# EAGLE design marquee-control (EAGLE 5.11)
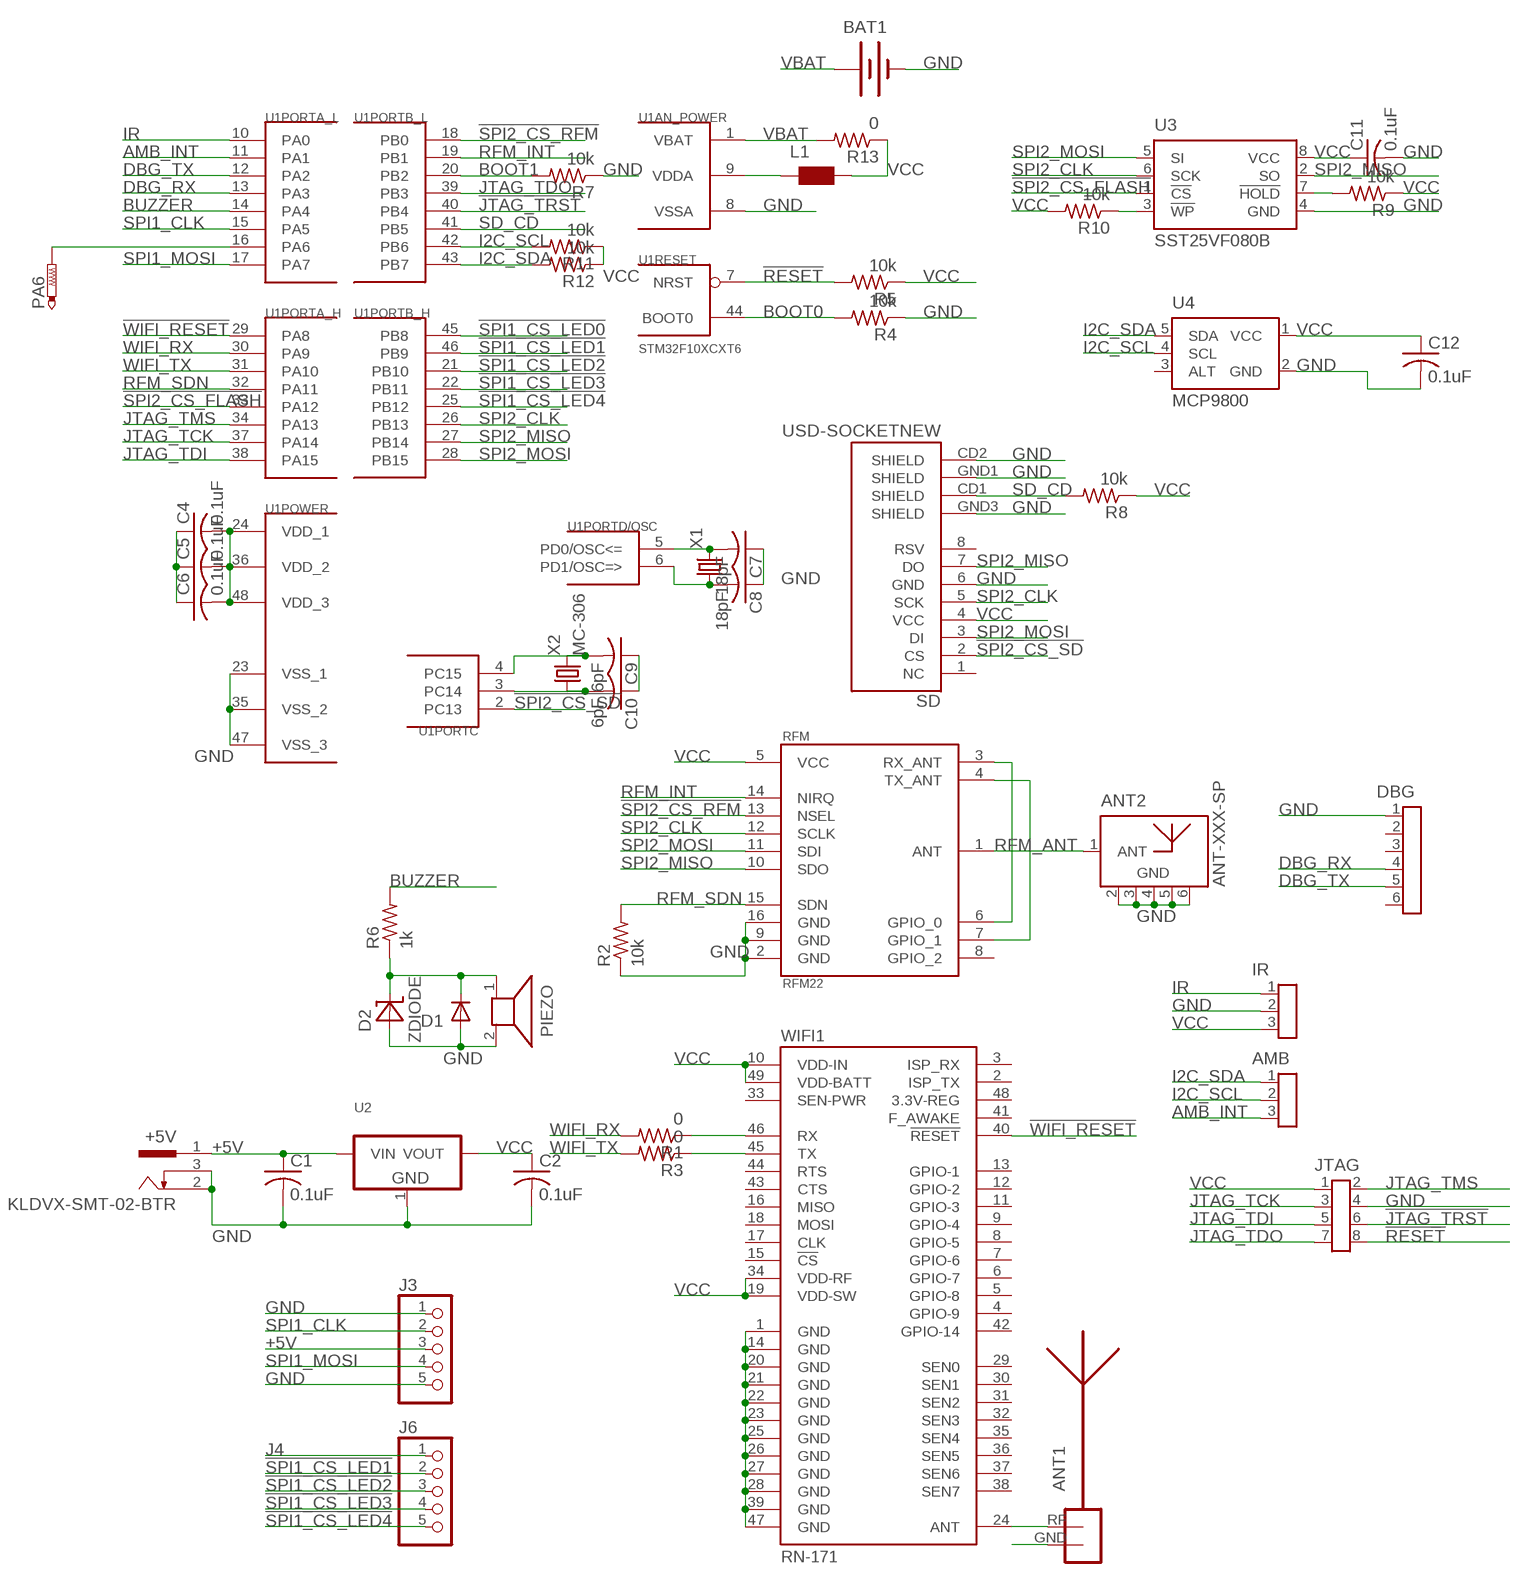
[diagram p0: schematic, sheet 1]

## Parts
+5V  KLDVX-SMT-02-BTR  [KLDVX-SMT-02-BTR]
AMB  PH-3  [SIL-3]
ANT1  ANTENNA_1LEFT  [SWRA117D_LEFT]
ANT2  ANT-XXX-SP  [ANT-XXX-SP]
BAT1  BATTERY12MM  [BATTCON_12MM]
C1  0.1uF  C-USC0603  [C0603]
C2  0.1uF  C-USC0603  [C0603]
C4  0.1uF  C-USC0603  [C0603]
C5  0.1uF  C-USC0603  [C0603]
C6  0.1uF  C-USC0603  [C0603]
C7  18pF  C-USC0603  [C0603]
C8  18pF  C-USC0603  [C0603]
C9  6pF  C-USC0603  [C0603]
C10  6pF  C-USC0603  [C0603]
C11  0.1uF  C-USC0603  [C0603]
C12  0.1uF  C-USC0603  [C0603]
D1  1N4148DO35-7  DIODE-SOD123  [SOD123]
D2  ZDIODE  [SOD-123]
DBG  PH-6  [SIL-6]
IR  PH-3  [SIL-3]
J3  PINHD-1X5  [1X05]
J6  PINHD-1X5  [1X05]
JTAG  PH-2X4  [DIL-8]
L1  WE-CBF_0603  [0603]
PA6  PTR1B1,27  [B1,27]
PIEZO  AST1628MATRQ  [AST1628MATRQ]
R1  0  R-US_R0603  [R0603]
R2  10k  R-US_R0603  [R0603]
R3  0  R-US_R0603  [R0603]
R4  10k  R-US_R0603  [R0603]
R5  10k  R-US_R0603  [R0603]
R6  1k  R-US_R0603  [R0603]
R7  10k  R-US_R0603  [R0603]
R8  10k  R-US_R0603  [R0603]
R9  10k  R-US_R0603  [R0603]
R10  10k  R-US_R0603  [R0603]
R11  10k  R-US_R0603  [R0603]
R12  10k  R-US_R0603  [R0603]
R13  0  R-US_R0603  [R0603]
RFM  RFM22  [RFM22-XXX-S2]
SD  USD-SOCKETNEW  [MICRO-SD-SOCKET-PP]
U1  STM32F10XCXT6  [TQFP48]
U2  LD1117-3.3SOT223  [SOT223]
U3  SST25VF080B  [SO-08]
U4  MCP9800  [SOT23-5L]
WIFI1  RN-171  [RN-171]
X1  CRYSTALCTS406  [CTS406]
X2  MC-306  [MC-306]

## Nets
!JTAG_TRST: JTAG.6 U1.40(PORTB_L:PB4)
!RESET: JTAG.8 R5.2 U1.7(RESET:NRST)
!SPI1_CS_LED0: U1.45(PORTB_H:PB8)
!SPI1_CS_LED1: J6.2 U1.46(PORTB_H:PB9)
!SPI1_CS_LED2: J6.3 U1.21(PORTB_H:PB10)
!SPI1_CS_LED3: J6.4 U1.22(PORTB_H:PB11)
!SPI1_CS_LED4: J6.5 U1.25(PORTB_H:PB12)
!SPI2_CS_FLASH: U1.33(PORTA_H:PA12) U3.1(!CS)
!SPI2_CS_RFM: RFM.13(NSEL) U1.18(PORTB_L:PB0)
!SPI2_CS_SD: SD.2(CS) U1.2(PORTC:PC13)
!WIFI_RESET: U1.29(PORTA_H:PA8) WIFI1.40(!RESET)
+5V: +5V.1 C1.1 J3.3 U2.3(VIN)
AMB_INT: AMB.3 U1.11(PORTA_L:PA1)
BOOT0: R4.2 U1.44(RESET:BOOT0)
BOOT1: R7.2 U1.20(PORTB_L:PB2)
BUZZER: R6.2 U1.14(PORTA_L:PA4)
DBG_RX: DBG.4 U1.13(PORTA_L:PA3)
DBG_TX: DBG.5 U1.12(PORTA_L:PA2)
GND: +5V.2 +5V.3 ANT1.GND ANT2.2(GND) ANT2.3(GND) ANT2.4(GND) ANT2.5(GND) ANT2.6(GND) BAT1.GND(-) C1.2 C2.2 C4.1 C5.1 C6.1 C7.1 C8.1 C9.1 C10.1 C11.2 C12.2 D1.A D2.A DBG.1 IR.2 J3.1 J3.5 JTAG.4 PIEZO.2 R2.1 R4.1 R7.1 RFM.2(GND) RFM.9(GND) RFM.16(GND) SD.6(GND) SD.CD2(SHIELD) SD.GND1(SHIELD) SD.GND3(SHIELD) U1.8(AN_POWER:VSSA) U1.23(POWER:VSS_1) U1.35(POWER:VSS_2) U1.47(POWER:VSS_3) U2.1(GND) U3.4(GND) U4.2(GND) WIFI1.1(GND) WIFI1.14(GND) WIFI1.20(GND) WIFI1.21(GND) WIFI1.22(GND) WIFI1.23(GND) WIFI1.25(GND) WIFI1.26(GND) WIFI1.27(GND) WIFI1.28(GND) WIFI1.39(GND) WIFI1.47(GND)
I2C_SCL: AMB.2 R11.2 U1.42(PORTB_L:PB6) U4.4(SCL)
I2C_SDA: AMB.1 R12.2 U1.43(PORTB_L:PB7) U4.5(SDA)
IR: IR.1 U1.10(PORTA_L:PA0)
J4: J6.1
JTAG_TCK: JTAG.3 U1.37(PORTA_H:PA14)
JTAG_TDI: JTAG.5 U1.38(PORTA_H:PA15)
JTAG_TDO: JTAG.7 U1.39(PORTB_L:PB3)
JTAG_TMS: JTAG.2 U1.34(PORTA_H:PA13)
N$1: D1.C D2.C PIEZO.1 R6.1
N$2: RFM.3(RX_ANT) RFM.6(GPIO_0)
N$3: RFM.4(TX_ANT) RFM.7(GPIO_1)
N$9: PA6.TP U1.16(PORTA_L:PA6)
N$10: L1.1 U1.9(AN_POWER:VDDA)
N$11: C7.2 U1.5(PORTD/OSC:PD0/OSC<=) X1.3
N$12: C8.2 U1.6(PORTD/OSC:PD1/OSC=>) X1.1
N$13: C10.2 U1.3(PORTC:PC14) X2.1
N$14: C9.2 U1.4(PORTC:PC15) X2.4
N$15: R10.1 U3.3(!WP)
N$18: R1.1 WIFI1.46(RX)
N$19: R3.1 WIFI1.45(TX)
N$22: R9.2 U3.7(!HOLD)
RFM_ANT: ANT2.1(ANT) RFM.1(ANT)
RFM_INT: RFM.14(NIRQ) U1.19(PORTB_L:PB1)
RFM_SDN: R2.2 RFM.15(SDN) U1.32(PORTA_H:PA11)
SD_CD: R8.2 SD.CD1(SHIELD) U1.41(PORTB_L:PB5)
SPI1_CLK: J3.2 U1.15(PORTA_L:PA5)
SPI1_MOSI: J3.4 U1.17(PORTA_L:PA7)
SPI2_CLK: RFM.12(SCLK) SD.5(SCK) U1.26(PORTB_H:PB13) U3.6(SCK)
SPI2_MISO: RFM.10(SDO) SD.7(DO) U1.27(PORTB_H:PB14) U3.2(SO)
SPI2_MOSI: RFM.11(SDI) SD.3(DI) U1.28(PORTB_H:PB15) U3.5(SI)
VBAT: BAT1.PWR@1(+) R13.2 U1.1(AN_POWER:VBAT)
VCC: C2.1 C4.2 C5.2 C6.2 C11.1 C12.1 IR.3 JTAG.1 L1.2 R5.1 R8.1 R9.1 R10.2 R11.1 R12.1 R13.1 RFM.5(VCC) SD.4(VCC) U1.24(POWER:VDD_1) U1.36(POWER:VDD_2) U1.48(POWER:VDD_3) U2.2(VOUT) U3.8(VCC) U4.1(VCC) WIFI1.10(VDD-IN) WIFI1.19(VDD-SW) WIFI1.34(VDD-RF) WIFI1.49(VDD-BATT)
WIFI_ANT: ANT1.RF WIFI1.24(ANT)
WIFI_RX: R1.2 U1.30(PORTA_H:PA9)
WIFI_TX: R3.2 U1.31(PORTA_H:PA10)
Unconnected: DBG.2 DBG.3 DBG.6 RFM.8(GPIO_2) SD.1(NC) SD.8(RSV) U4.3(ALT) WIFI1.2(ISP_TX) WIFI1.3(ISP_RX) WIFI1.4(GPIO-9) WIFI1.5(GPIO-8) WIFI1.6(GPIO-7) WIFI1.7(GPIO-6) WIFI1.8(GPIO-5) WIFI1.9(GPIO-4) WIFI1.11(GPIO-3) WIFI1.12(GPIO-2) WIFI1.13(GPIO-1) WIFI1.15(!CS) WIFI1.16(MISO) WIFI1.17(CLK) WIFI1.18(MOSI) WIFI1.29(SEN0) WIFI1.30(SEN1) WIFI1.31(SEN2) WIFI1.32(SEN3) WIFI1.33(SEN-PWR) WIFI1.35(SEN4) WIFI1.36(SEN5) WIFI1.37(SEN6) WIFI1.38(SEN7) WIFI1.41(F_AWAKE) WIFI1.42(GPIO-14) WIFI1.43(CTS) WIFI1.44(RTS) WIFI1.48(3.3V-REG)

## Library data of the parts
+5V = marquee-control:KLDVX-SMT-02-BTR
AMB IR = marquee-control:PH-3
ANT1 = ant-planar:ANTENNA_1
ANT2 = linx:ANT-XXX-SP: ANT-315-SP Source: http://www.antennafactor.com/documents/ANT-315-SP_Data_Sheet.pdf; OC_FARNELL: unknown; OC_NEWARK: unknown
BAT1 = sparkfun:BATTERY: Battery Holders Various common sizes : AA, AAA, 20mm coin cell and 12mm coin cell.
C1 C2 C4-C12 = rcl:C-US: CAPACITOR, American symbol
D1 = diode:DIODE-: DIODE
D2 = marquee-control:ZDIODE
DBG = marquee-control:PH-6
J3 J6 = pinhead:PINHD-1X5: PIN HEADER
JTAG = marquee-control:PH-2X4
L1 = wuerth-elektronik:WE-CBF: SMD EMI Suppression Ferrite Beads - excellent anti-EMI properties - low DCR - impedances till 3000 ohms - rated current up to 6 A
PA6 = testpad:PTR1: TEST PIN
PIEZO = marquee-control:AST1628MATRQ: Audio Indicators & Alerts 3MM HEIGHT 4000HZ 85DB Datasheet <http://www.mallory-sonalert.com/specifications/AST1628MATRQ.pdf>
R1-R13 = rcl:R-US_: RESISTOR, American symbol
RFM = sparkfun:RFM22: *Hope RF's RFM22* Packages: RFM22-S2 (SMD)
SD = sparkfun:USD-SOCKET: microSD Socket Push-push type uSD socket. Schematic element and footprint production proven. Spark Fun Electronics SKU : PRT-00127. tDoc lines correctly indicate media card edge positions when inserting (unlocked, locked, depressed).
U1 = stm32:STM32F10XCXT6: ST STM32F101/103 48pin LQFP
U2 = dp_devices:LD1117-3.3
U3 = marquee-control:SST25VF080B
U4 = marquee-control:MCP9800
WIFI1 = marquee-control:RN-171: Roving Netowrks WiFLy GSX Module
X1 = crystal:CRYSTAL: CRYSTAL; OC_FARNELL: unknown; OC_NEWARK: unknown
X2 = crystal:MC-306: kHz RANGE CRYSTAL UNIT SMD Source: MC-306_405_406_E07X.PDF Homepage <www.epsontoyocom.co.jp>; MPN: MC-306 60.0KHZ 100PPM ,12.5PF; OC_FARNELL: 1278040; OC_NEWARK: 31M5576

## Board
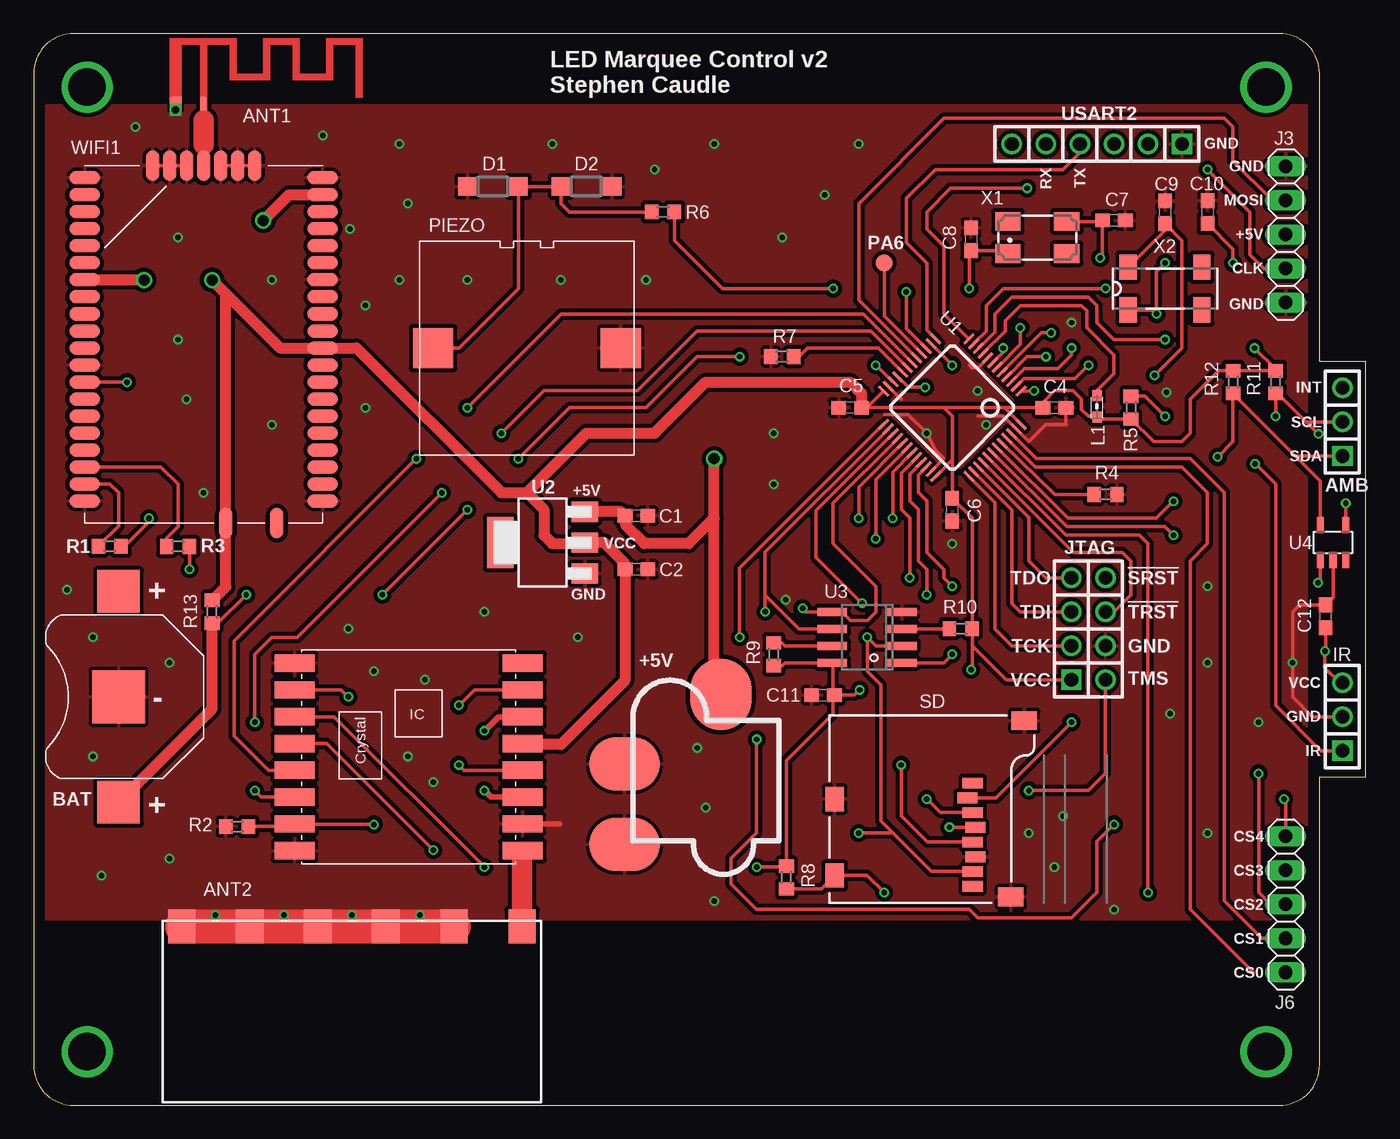
[diagram p1: board, top side]
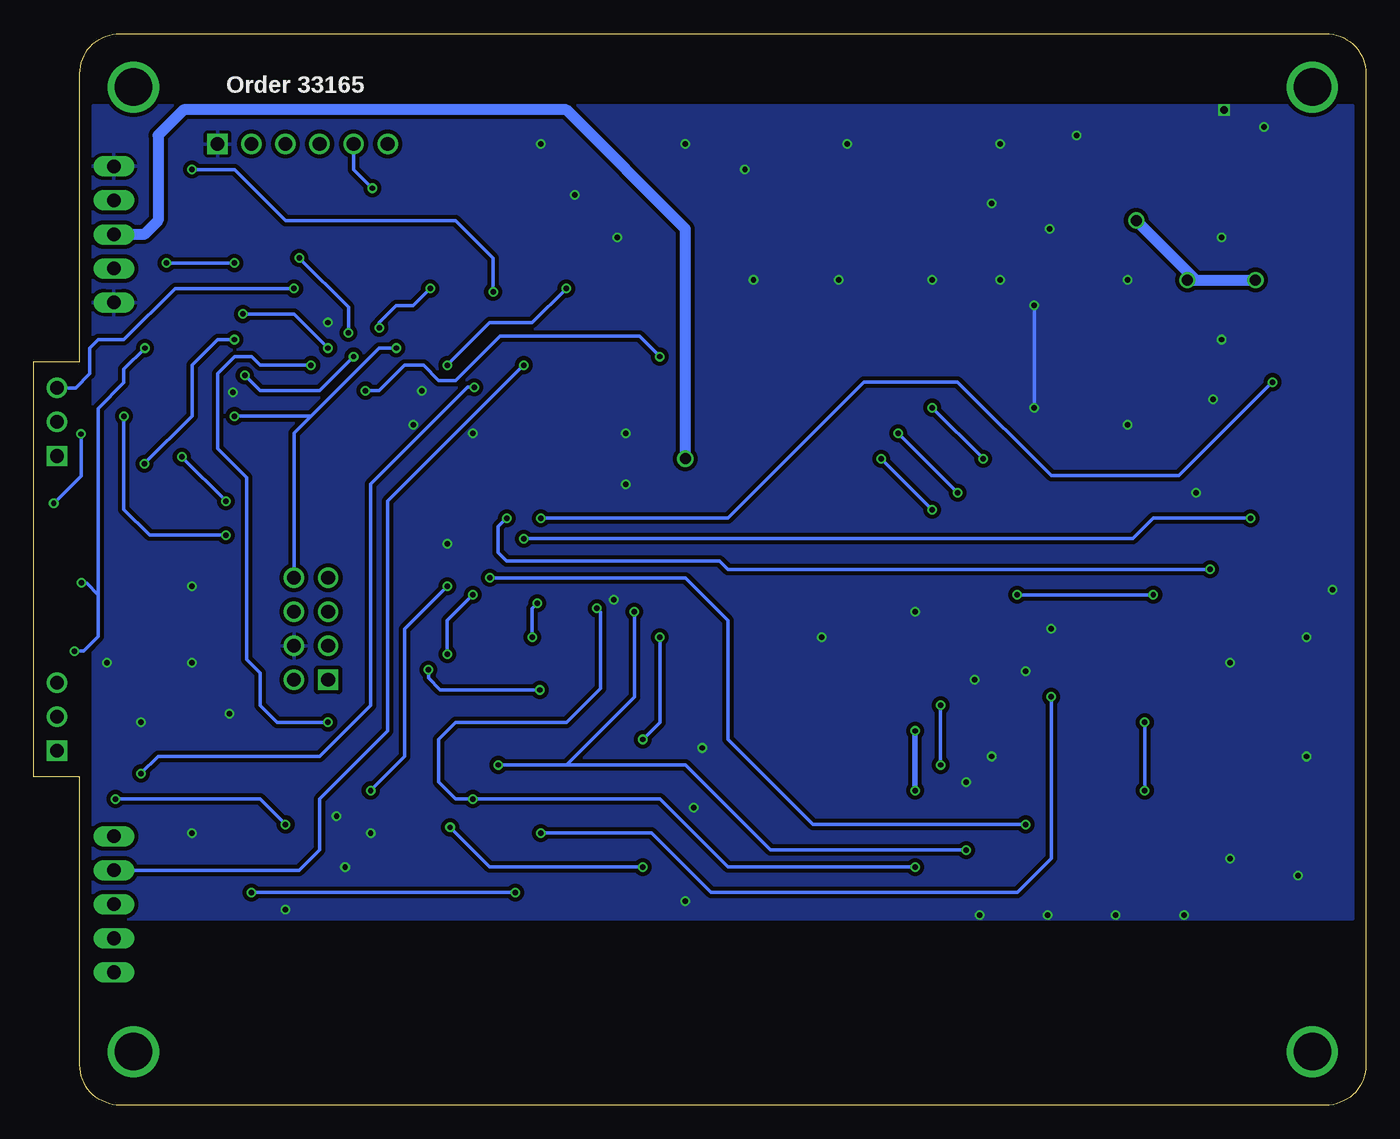
[diagram p2: board, bottom side, seen from below]

Size 99.46 x 80 mm. Coordinates in mm from the lower left corner, seen from the top.
Outline: 96,24.5 99.46,24.5 99.46,55.5 96,55.5 96,77 arc90 93,80 3,80 arc90 0,77 0,3 arc90 3,0 93,0 arc90 96,3 96,24.5
Copper layers (1*16): Top 0.035mm / dielectric 1.5mm / Bottom 0.035mm
Design rules "Fusion_eagle_rule_v1.1 *": minimum track width 6mil, minimum drill 12mil, track to track 6mil, track to pad 6mil, pad to pad 6mil, via to via 6mil, smd to smd 0mil, copper to edge 10mil, drill to drill 10mil, minimum pad ring 10mil, minimum via ring 6mil, stop-mask expansion 2mil, vias tented up to drill 22mil, thermal gap 10mil

### Footprints (pad centres in the part's own frame; a part is rotated, then mirrored left to right if it is on the bottom)
KLDVX-SMT-02-BTR = smd 5.35 x 4.6: 1 -6.425,1.1 | smd 4 x 5.25: 2 -1.25,-6.075; 3 4.75,-6.075
SIL-3 = drill 1.016 square: 1 -2.54,0 | drill 1.016 round: 2 0,0; 3 2.54,0
SWRA117D_LEFT = smd 0.9 x 1: GND 0.45,0.5 | smd 0.5 x 1: RF 2.55,0.51
ANT-XXX-SP = smd 2.032 x 2.54: 1 -12.7,0; 2 -7.62,0; 3 -2.54,0; 4 2.54,0; 5 7.62,0; 6 12.7,0
BATTCON_12MM = smd 3.962 x 3.962: GND 0,0 | smd 3.175 x 3.175: PWR@1 -7.874,0; PWR@2 7.874,0
C0603 = smd 1.1 x 1: 1 -0.85,0; 2 0.85,0
SOD123 = smd 1.4 x 1.4: A 1.9,0; C -1.9,0
SOD-123 = smd 1.4 x 1.4: A 1.9,0; C -1.9,0
SIL-6 = drill 1.016 square: 1 -6.35,0 | drill 1.016 round: 2 -3.81,0; 3 -1.27,0; 4 1.27,0; 5 3.81,0; 6 6.35,0
1X05 = drill 1.016 long: 1 -5.08,0; 2 -2.54,0; 3 0,0; 4 2.54,0; 5 5.08,0
DIL-8 = drill 1.016 square: 1 -3.81,1.27 | drill 1.016 round: 2 -3.81,-1.27; 3 -1.27,1.27; 4 -1.27,-1.27; 5 1.27,1.27; 6 1.27,-1.27; 7 3.81,1.27; 8 3.81,-1.27
0603 = smd 0.85 x 0.7: 1 -0.9,0; 2 0.7,0
B1,27 = smd 1.27 x 1.27: TP 0,0
AST1628MATRQ = smd 3 x 3: 1 0,7; 2 0,-7
R0603 = smd 1 x 1.1: 1 -0.85,0; 2 0.85,0
RFM22-XXX-S2 = smd 3 x 1.3: 1 -8.5,7; 2 -8.5,5; 3 -8.5,3; 4 -8.5,1; 5 -8.5,-1; 6 -8.5,-3; 7 -8.5,-5; 8 -8.5,-7; 9 8.5,-7; 10 8.5,-5; 11 8.5,-3; 12 8.5,-1; 13 8.5,1; 14 8.5,3; 15 8.5,5; 16 8.5,7
MICRO-SD-SOCKET-PP = smd 0.8 x 1.5: 1 -8.94,10.7; 2 -7.84,10.3; 3 -6.74,10.7; 4 -5.64,10.9; 5 -4.54,10.7; 6 -3.44,10.9; 7 -2.34,10.7; 8 -1.24,10.7 | smd 1.8 x 1.4: CD1 -2.05,0.4; CD2 -7.75,0.4 | smd 1.4 x 1.9: GND1 -13.6,14.55; GND3 -0.45,13.55
TQFP48 = smd 0.2 x 1: 1 -2.75,-4.5; 2 -2.25,-4.5; 3 -1.75,-4.5; 4 -1.25,-4.5; 5 -0.75,-4.5; 6 -0.25,-4.5; 7 0.25,-4.5; 8 0.75,-4.5; 9 1.25,-4.5; 10 1.75,-4.5; 11 2.25,-4.5; 12 2.75,-4.5; 25 2.75,4.5; 26 2.25,4.5; 27 1.75,4.5; 28 1.25,4.5; 29 0.75,4.5; 30 0.25,4.5; 31 -0.25,4.5; 32 -0.75,4.5; 33 -1.25,4.5; 34 -1.75,4.5; 35 -2.25,4.5; 36 -2.75,4.5 | smd 1 x 0.2: 13 4.5,-2.75; 14 4.5,-2.25; 15 4.5,-1.75; 16 4.5,-1.25; 17 4.5,-0.75; 18 4.5,-0.25; 19 4.5,0.25; 20 4.5,0.75; 21 4.5,1.25; 22 4.5,1.75; 23 4.5,2.25; 24 4.5,2.75; 37 -4.5,2.75; 38 -4.5,2.25; 39 -4.5,1.75; 40 -4.5,1.25; 41 -4.5,0.75; 42 -4.5,0.25; 43 -4.5,-0.25; 44 -4.5,-0.75; 45 -4.5,-1.25; 46 -4.5,-1.75; 47 -4.5,-2.25; 48 -4.5,-2.75
SOT223 = smd 1.5 x 2: 1 -2.3,-3.15; 2 0,-3.15; 3 2.3,-3.15 | smd 3.8 x 2: 4 0,3.15
SO-08 = smd 0.6 x 2.2: 1 -1.905,-2.6; 2 -0.635,-2.6; 3 0.635,-2.6; 4 1.905,-2.6; 5 1.905,2.6; 6 0.635,2.6; 7 -0.635,2.6; 8 -1.905,2.6
SOT23-5L = smd 0.55 x 1.2: 1 -0.95,-1.3; 2 0,-1.3; 3 0.95,-1.3; 4 0.95,1.3; 5 -0.95,1.3
RN-171 = smd 1.016 x 2.286: 1 25.019,8.89; 2 23.749,8.89; 3 22.479,8.89; 4 21.209,8.89; 5 19.939,8.89; 6 18.669,8.89; 7 17.399,8.89; 8 16.129,8.89; 9 14.859,8.89; 10 13.589,8.89; 11 12.319,8.89; 12 11.049,8.89; 13 9.779,8.89; 14 8.509,8.89; 15 7.239,8.89; 16 5.969,8.89; 17 4.699,8.89; 18 3.429,8.89; 19 2.159,8.89; 20 0.889,8.89; 28 0.889,-8.89; 29 2.159,-8.89; 30 3.429,-8.89; 31 4.699,-8.89; 32 5.969,-8.89; 33 7.239,-8.89; 34 8.509,-8.89; 35 9.779,-8.89; 36 11.049,-8.89; 37 12.319,-8.89; 38 13.589,-8.89; 39 14.859,-8.89; 40 16.129,-8.89; 41 17.399,-8.89; 42 18.669,-8.89; 43 19.939,-8.89; 44 21.209,-8.89; 45 22.479,-8.89; 46 23.749,-8.89; 47 25.019,-8.89 | smd 2.286 x 1.016: 21 0,3.81; 22 0,2.54; 23 0,1.27; 24 0,0; 25 0,-1.27; 26 0,-2.54; 27 0,-3.81; 48 26.67,5.461; 49 26.67,1.651
CTS406 = smd 1.9 x 1.4: 1 -2.2,-1.2; 2 2.2,-1.2; 3 2.2,1.2; 4 -2.2,1.2
MC-306 = smd 1.3 x 1.9: 1 -2.75,-1.6; 2 2.75,-1.6; 3 2.75,1.6; 4 -2.75,1.6

### Placement (x,y rotation side)
+5V  50.2,24.23 270 top
AMB  97.7,51 90 top
ANT1  10.15,74.25 0 top
ANT2  23.77,13.34 180 top
BAT1  6.35,30.48 90 top
C1  45,44 0 top
C2  45,40 0 top
C4  76.2,52.07 180 top
C5  60.96,52.07 0 top
C6  68.58,44.45 90 top
C7  80.64,66.04 180 top
C8  69.98,64.64 270 top
C9  84.47,66.65 270 top
C10  87.63,66.67 270 top
C11  58.93,30.61 180 top
C12  96.45,36.5 90 top
D1  34.29,68.58 180 top
D2  41.27,68.58 0 top
DBG  79.38,71.75 180 top
IR  97.7,29 90 top
J3  93.46,65 90 top
J6  93.46,15 90 top
JTAG  78.74,35.56 90 top
L1  79.38,52.07 270 top
PA6  63.5,62.87 0 top
PIEZO  36.83,56.52 90 top
R1  5.69,41.73 0 top
R2  15.2,20.8 0 top
R3  10.79,41.71 0 top
R4  80.01,45.59 180 top
R5  81.92,52.07 90 top
R6  46.99,66.67 0 top
R7  55.88,55.88 0 top
R8  56.2,17 270 top
R9  55.24,33.66 90 top
R10  69.22,35.56 0 top
R11  92.71,53.98 270 top
R12  89.53,53.98 270 top
R13  13.34,36.83 270 top
RFM  28,26 180 top
SD  59.4,15.1 270 top
U1  68.58,52.07 135 top
U2  38,42 90 top
U3  62.23,34.92 90 top
U4  97,42 0 top
WIFI1  12.7,70.12 270 top
X1  74.93,64.77 0 top
X2  84.45,60.96 0 top

### Tracks (layer width: path | path; a pad name or v marks a point on that pad's centre or on a via)
!JTAG_TRST
  Top 0.254: U1.40 77.61,41.27 81.28,41.27 81.92,40.64 81.92,38.1 80.64,36.83 JTAG.6
!RESET  (via drill 0.41)
  Top 0.254: v84.45,51.44 82.97,52.92 R5.2 | U1.7 72.39,56.23 v72.39,56.52
  Bottom 0.254: v72.39,56.52 73.66,56.52 78.74,51.44 | 78.74,51.44 v84.45,51.44 | JTAG.8 80.01,50.16 78.74,51.44
!SPI1_CS_LED0
  Top 0.254: U1.45 74.79,47.62 85.72,47.62 87.63,45.72 87.63,41.91 86.36,40.64 86.36,14.61 91.05,9.92
!SPI1_CS_LED1
  Top 0.254: U1.46 74.86,48.26 86.36,48.26 88.9,45.72 88.9,15.24 91.68,12.46 J6.2
!SPI1_CS_LED2  (via drill 0.41)
  Top 0.254: v91.44,24.77 91.44,15.88 92.31,15 J6.3 | U1.21 65.29,53.59 v66.55,53.59
  Bottom 0.254: J6.3 93.45,14.99 | v91.44,24.77 90.17,26.04 78.11,26.04 74.3,29.84 74.3,46.35 67.06,53.59 v66.55,53.59
!SPI1_CS_LED3  (via drill 0.41)
  Top 0.254: v62.87,55.24 64.1,54.01 U1.22
  Bottom 0.254: J6.4 79.61,17.54 78.11,19.05 78.11,22.86 73.03,27.94 73.03,45.09 v62.87,55.24
!SPI1_CS_LED4  (via drill 0.41)
  Top 0.254: U1.25 52.7,40.08 v52.7,34.92 | v53.98,27.3 53.98,20.32 52.07,18.41 52.07,16.51 53.98,14.61 69.85,14.61 70.48,13.97 77.47,13.97 79.38,15.88 79.38,19.68 v80.64,20.95 | v93.34,22.86 93.46,22.75 J6.5
  Bottom 0.254: v52.7,34.92 52.7,28.57 v53.98,27.3 | v80.64,20.95 82.55,22.86 v93.34,22.86
!SPI2_CS_FLASH  (via drill 0.41)
  Top 0.254: U1.33 65.41,47.13 65.41,45.09 66.04,44.45 66.04,40.64 66.67,40.01 v66.67,38.1 | v68.58,33.66 67.94,33.02 U3.1
  Bottom 0.254: v66.67,38.1 68.58,36.2 v68.58,33.66
!SPI2_CS_RFM  (via drill 0.41)
  Top 0.254: U1.18 61.95,59.05 39.37,59.05 v32.38,52.07 | v28.57,48.26 14.99,34.67 14.99,27.56 17.55,25 RFM.13
  Bottom 0.254: v28.57,48.26 v32.38,52.07
!SPI2_CS_SD  (via drill 0.41)
  Top 0.254: U1.2 73.92,54.23 77.72,54.23 v78.74,55.24 | 69.14,22.94 SD.2 71.83,22.94 v77.47,28.57
  Bottom 0.254: v77.47,28.57 81.28,28.57 82.55,29.84 82.55,32.26 83.57,33.27 83.57,46.86 85.72,49.02 85.72,54.61 84.45,55.88 83.19,55.88 82.55,55.24 v78.74,55.24
!WIFI_RESET  (via drill 0.41)
  Top 0.254: U1.29 61.59,46.15 v61.59,43.81 | v6.99,53.98 3.83,53.98 WIFI1.40
  Bottom 0.254: v61.59,43.81 47.62,43.81 37.47,53.98 30.48,53.98 23.5,46.99 13.97,46.99 v6.99,53.98
+5V  (via drill 0.81)
  Top 0.813: U2.3 43.85,44.3 C1.1 44.2,43.95 44.2,43.31 45.59,41.91 48.9,41.91 50.8,43.81 | 50.8,43.81 v50.8,48.26 | 50.8,43.81 50.8,31.43 +5V.1
  Bottom 0.813: J3.3 91.21,65 90.17,66.04 90.17,72.39 88.27,74.3 59.69,74.3 50.8,65.41 v50.8,48.26
AMB_INT  (via drill 0.41)
  Top 0.254: U1.11 71.12,57.79 71.12,59.69 72.39,60.96 v80.01,60.96
  Bottom 0.254: v80.01,60.96 88.9,60.96 92.71,57.15 94.61,57.15 95.25,56.52 95.25,54.61 96.32,53.54 AMB.3
BOOT0
  Top 0.254: U1.44 76.25,45.59 R4.2
BOOT1
  Top 0.254: U1.20 63.07,56.52 57.78,56.52 57.15,55.88 R7.2
BUZZER  (via drill 0.41)
  Top 0.254: U1.14 68.58,55.25 v68.58,55.24 | v59.69,60.96 51.44,60.96 47.84,64.56 R6.2
  Bottom 0.254: v68.58,55.24 65.41,58.42 62.23,58.42 v59.69,60.96
DBG_RX
  Top 0.254: U1.13 66.67,57.86 66.67,62.87 65.15,64.39 65.15,67.69 67.31,69.85 76.83,69.85 78.11,71.12 DBG.4
DBG_TX  (via drill 0.41)
  Top 0.254: U1.12 67.94,59.07 67.94,64.14 66.67,65.41 66.67,66.67 68.45,68.45 v74.17,68.45
  Bottom 0.254: v74.17,68.45 75.56,69.85 DBG.5
GND  (via drill 0.41, 0.53)
  Top 0.254: U1.47 72.4,51.44 72.39,51.44 | 72.39,51.44 74.3,49.53 75.56,50.8 77.09,50.8 77.05,50.84 C4.1 | U1.35 67.94,48.25 | 67.94,48.25 67.94,48.26 | U1.23 64.76,52.7 64.77,52.7 | 69.85,55.24 70.02,55.07 70.53,55.07 70.53,55.08 U1.8 | 72.39,51.44 70.48,51.44 | 67.94,48.25 67.31,48.89 v66.67,50.16 65.28,51.56 63.5,51.56 | U4.2 97,37.9 C12.2 94.5,37.35 93.98,36.83 v93.98,33.02 | v93.98,33.02 93.98,32.38 | v93.98,33.02 93.98,30.48 95.46,29 IR.2 | WIFI1.25 WIFI1.26 WIFI1.27 | WIFI1.21 WIFI1.22 WIFI1.23 | WIFI1.14 21.61,61.59
  Top 0.305: ANT2.6 12.7,13.34 v13.56,14.2 | ANT2.5 17.01,14.2 v18.69,14.2 20.36,14.2 ANT2.4 | v23.77,14.2 25.44,14.2 ANT2.3
  Top 0.406: RFM.2 39.26,21 39.27,21.01
  Top 0.889: ANT1.GND
  Top 2.54: ANT2.6 ANT2.5 ANT2.4 ANT2.3 ANT2.2
  Bottom 0.254: v24.77,52.07 v24.77,59.69
  other vias: 28.83,14.2 10.6,74.3 39.37,61.59 55.24,50.16 55.24,46.35 27.3,61.59 11.43,52.7 10.79,57.15 10.79,64.77 17.78,61.59 17.78,50.8 12.7,45.72 23.5,35.56 27.94,26.04 29.84,24.13 25.4,32.38 29.21,31.75 59.05,67.94 50.8,71.75 55.88,64.77 61.59,71.75 27.3,71.75 87.63,38.73 87.63,33.02 84.84,29.21 74.3,20.32 80.64,14.61 91.44,28.57 49.53,26.67 50.16,22.23 38.73,71.75 70.48,53.34 77.47,58.42 76.2,17.78 76.83,21.59 68.58,41.91 50.8,15.24 71.12,50.8 87.63,20.32 56.13,37.72 27.94,67.31 21.59,72.39 7.62,73.03 10.16,33.02 5.08,17.14 10.16,18.41 33.66,36.83 40.64,34.92 46.35,69.85 32.38,61.59 23.62,65.41 84.58,53.21 4.45,34.92 4.45,26.04 2.51,38.48 45.72,61.59
  pour Bottom (isolate 0.305): 1,13.9 95,13.9 95,74.62 1,74.62
  pour Top (isolate 0.305): 1,13.9 95,13.9 95,74.62 1,74.62
  pour Top (no thermals): 11.43,72.39 9.53,72.39 9.53,74.62 11.43,74.62
  pour Top (no thermals): 9.53,15.24 33.02,15.24 33.02,13.9 9.53,13.9
I2C_SCL  (via drill 0.41)
  Top 0.254: v92.71,51.44 R11.2 92.88,53.12 95.01,50.99 | U1.42 77.12,43.18 84.45,43.18 v85.09,42.55 | v97.95,44.92 U4.4 | 95.01,50.99 v95.9,50.1 | AMB.2 95.01,50.99
  Bottom 0.254: v85.09,42.55 90.81,42.55 92.71,44.45 v92.71,51.44 | 95.9,46.98 95.89,46.99 | v95.9,50.1 95.9,46.98 | 95.9,46.98 v97.95,44.92
I2C_SDA  (via drill 0.41)
  Top 0.254: v88.39,48.39 89.53,49.53 R12.2 94.01,48.65 94.2,48.46 | U1.43 77.19,43.81 83.82,43.81 v85.09,45.09 | U4.5 96.05,46.61 94.2,48.46 | 94.2,48.46 AMB.1
  Bottom 0.254: v85.09,45.09 v88.39,48.39
IR  (via drill 0.41)
  Top 0.254: U1.10 71.75,57.72 71.75,59.05 73.03,60.33 78.74,60.33 79.38,59.69 79.38,58.42 80.64,57.15 v84.45,57.15 | v91.19,47.88 92.71,46.35 92.71,29.84 96.09,26.46 IR.1
  Bottom 0.254: v91.19,47.88 87.63,51.44 87.63,55.24 85.72,57.15 v84.45,57.15
JTAG_TCK
  Top 0.254: U1.37 71.75,45.01 71.75,35.56 73.03,34.29 JTAG.3
JTAG_TDI
  Top 0.254: U1.38 73.03,44.44 73.03,37.47 73.66,36.83 JTAG.5
JTAG_TDO
  Top 0.254: U1.39 74.3,43.88 74.3,40.64 75.56,39.37 JTAG.7
JTAG_TMS  (via drill 0.41)
  Top 0.254: U1.34 66.04,47.05 66.04,45.72 66.67,45.09 66.67,41.27 67.94,40.01 67.94,39.37 v68.58,38.73 | v74.3,23.5 78.74,23.5 80.01,24.77 JTAG.2
  Bottom 0.254: v68.58,38.73 71.75,35.56 71.75,26.04 v74.3,23.5
N$1
  Top 0.254: PIEZO.1 31.75,56.52 36.19,60.95 D1.C D2.C 39.37,67.31 40.01,66.67 R6.1
N$2  (via drill 0.41)
  Top 0.406: RFM.6 34.72,29 v33.66,27.94 | v33.66,23.5 34.15,23 RFM.3
  Bottom 0.406: v33.66,23.5 v33.66,27.94
N$3  (via drill 0.41)
  Top 0.254: RFM.7 32.91,31 v31.75,29.84 | v31.75,25.4 32.15,25 RFM.4
  Bottom 0.254: v31.75,25.4 v31.75,29.84
N$4  (via drill 2.8)
  other vias: 4,4
N$6  (via drill 2.8)
  other vias: 92,4
N$7  (via drill 2.8)
  other vias: 92,76
N$8  (via drill 2.8)
  other vias: 4,76
N$9
  Top 0.254: U1.16 63.5,58.92 PA6.TP
N$10
  Top 0.254: U1.9 72.53,57.78 72.53,58.56 73.66,59.69 78.23,59.69 78.61,59.31 78.61,58.04 80.64,56.01 80.64,54.61 79.38,53.34 L1.1
N$11  (via drill 0.41)
  Top 0.254: X1.3 79.72,65.97 C7.2 79.8,63.41 v79.63,63.25 | U1.5 75.23,57.66 v75.95,57.66
  Bottom 0.254: v79.63,63.25 75.95,59.56 v75.95,57.66
N$12  (via drill 0.41)
  Top 0.254: X1.1 72.51,63.79 C8.2 69.85,63.67 v69.85,60.96 | U1.6 73.66,56.8 v73.66,58.04
  Bottom 0.254: v69.85,60.96 71.12,59.69 72.39,59.69 73.66,58.42 v73.66,58.04
N$13  (via drill 0.41)
  Top 0.254: X2.1 83.52,59.36 v83.82,59.05 83.82,62.23 v84.45,62.87 | v89.53,62.87 89.53,63.92 C10.2 | U1.3 73.98,54.99 76.45,54.99 77.47,56.01 v77.47,56.52
  Bottom 0.254: v84.45,62.87 v89.53,62.87 | v77.47,56.52 80.01,59.05 v83.82,59.05
N$14  (via drill 0.41)
  Top 0.254: C9.2 84.47,65.32 X2.4 | U1.4 74.16,55.88 v75.56,55.88 | C9.2 84.47,66.03 | v83.69,54.48 85.72,56.52 85.72,64.54 C9.2 | C9.2 84.7,66.04
  Bottom 0.254: v75.56,55.88 78.11,53.34 82.55,53.34 v83.69,54.48
N$15
  Top 0.254: U3.3 R10.1
N$18
  Top 0.254: R1.1 6.35,43.24 6.35,45.72 5.7,46.37 WIFI1.46
N$19
  Top 0.254: R3.1 9.95,42.33 10.79,43.18 10.79,46.35 9.51,47.64 WIFI1.45
N$22
  Top 0.254: U3.7 56.09,34.29 55.88,34.51 R9.2
RFM_ANT
  Top 0.508: 36.46,18.37 36.46,18.96 RFM.1
  Top 1.524: ANT2.1 36.47,18.36 36.46,18.37
RFM_INT  (via drill 0.41)
  Top 0.254: U1.19 62.51,57.78 49.53,57.78 45.09,53.34 38.1,53.34 v34.92,50.16 | v30.48,45.72 19.68,34.92 17.78,34.92 16.51,33.66 v16.51,28.57 | v16.51,23.5 17,23 RFM.14
  Bottom 0.254: v30.48,45.72 v34.92,50.16 | v16.51,23.5 v16.51,28.57
RFM_SDN  (via drill 0.41)
  Top 0.254: R2.2 19.05,20.8 | 19.05,20.8 19.3,20.8 RFM.15 | U1.32 64.77,47.2 64.77,44.45 65.41,43.81 v65.41,39.37 | v25.4,20.95 19.2,20.95 19.05,20.8
  Bottom 0.254: v25.4,20.95 41.27,20.95 47.62,27.3 47.62,36.2 50.8,39.37 v65.41,39.37
SD_CD  (via drill 0.41)
  Top 0.254: R8.2 58.8,16.15 SD.CD1 62.23,17.15 v63.5,15.88 | U1.41 77.04,42.55 82.55,42.55 83.19,41.91 v83.19,15.88
  Bottom 0.254: v63.5,15.88 v83.19,15.88
SPI1_CLK  (via drill 0.41)
  Top 0.254: U1.15 65.15,57.97 v65.15,60.71 | v87.63,69.85 90.81,66.67 90.81,63.5 91.84,62.46 J3.2
  Bottom 0.254: v65.15,60.71 65.15,63.25 67.94,66.04 80.64,66.04 84.45,69.85 v87.63,69.85
SPI1_MOSI
  Top 0.254: J3.4 92.48,67.54 89.53,70.48 89.53,73.03 88.9,73.66 67.94,73.66 61.59,67.31 61.59,60.12 U1.17
SPI2_CLK  (via drill 0.41)
  Top 0.254: U1.26 54.61,41.28 54.61,38.1 | v54.61,36.83 54.61,38.1 | v64.77,25.4 64.77,21.59 66.72,19.64 SD.5 | U3.6 57.15,35.56 54.61,38.1 | RFM.12 21.89,27 v29.84,19.05
  Bottom 0.254: v54.61,36.83 54.61,30.48 59.69,25.4 | 59.69,25.4 v64.77,25.4 | v29.84,19.05 44.45,19.05 50.8,25.4 59.69,25.4
SPI2_MISO  (via drill 0.41)
  Top 0.254: U1.27 58.42,44.38 58.42,40.89 v61.85,37.47 | U3.2 62.87,34.29 v62.23,34.92 62.23,32.38 63.25,31.37 63.25,21.21 64.14,20.32 | SD.7 67.02,17.44 64.14,20.32 | RFM.10 22.98,31 v23.5,30.48 | v61.59,20.32 64.14,20.32
  Bottom 0.254: v61.85,37.47 62.23,37.08 v62.23,34.92 | v23.5,30.48 23.5,18.41 26.04,15.88 48.9,15.88 53.34,20.32 v61.59,20.32
SPI2_MOSI  (via drill 0.41)
  Top 0.254: U1.28 59.69,44.95 59.69,41.91 62.87,38.73 62.87,36.83 62.23,36.2 60.96,36.2 60.33,36.83 U3.5 57.66,36.83 v57.4,37.08 | RFM.11 22.43,29 v33.66,17.78 | SD.3 67.69,21.84 v66.67,22.86
  Bottom 0.254: v57.4,37.08 57.15,36.83 57.15,31.11 59.69,28.57 67.94,28.57 69.22,27.3 69.22,24.13 67.94,22.86 v66.67,22.86 52.7,22.86 47.62,17.78 v33.66,17.78
VBAT  (via drill 0.41)
  Top 0.254: U1.1 74.26,53.31 v74.68,53.34 | v52.7,55.88 49.53,55.88 45.72,52.07 40.01,52.07 v36.2,48.26 | v26.04,38.1 v32.38,44.45 | v15.88,38.1 13.76,35.98 R13.2
  Top 0.813: BAT1.PWR@1 13.34,29.59 R13.2
  Bottom 0.254: v74.68,53.34 73.66,53.34 71.75,55.24 70.36,55.24 69.22,54.1 67.94,54.1 64.64,57.4 54.23,57.4 v52.7,55.88 | v32.38,44.45 v36.2,48.26 | v15.88,38.1 v26.04,38.1
VCC  (via drill 0.41, 0.81)
  Top 0.254: C11.1 59.69,30.84 59.69,32.96 U3.8 56.09,33.02 55.88,32.8 R9.1 | C11.1 59.69,30.52 59.69,29.21 56.2,25.72 R8.1 56.13,17.78 v53.98,17.78 | C11.1 61.27,30.61 v61.66,31 | C4.2 75.44,52.16 75.44,52.58 76.2,53.34 77.6,53.34 78.23,52.7 78.23,51.94 78.74,51.44 79.31,51.44 L1.2 79.53,51.22 R5.1 83.61,49.53 85.72,49.53 86.36,50.16 86.36,52.7 88.48,54.83 R12.1 R11.1 | C4.2 74.94,52.07 | R11.1 93.13,54.83 | v68.36,20.74 SD.4 | v69.98,32.51 70.06,32.6 70.06,34.29 | 70.06,34.29 R10.2 70.06,43.81 C6.2 68.58,48.18 | JTAG.1 72.61,31.75 70.06,34.29 | 72.47,52.07 C4.2 | 72.47,52.07 U1.48 | 67.94,52.07 C5.2 62.22,52.07 U1.24 | 67.94,52.07 72.47,52.07 | 67.94,52.07 68.58,51.44 68.58,48.18 | 68.58,48.18 U1.36 | U4.1 96.05,39.15 v95.89,38.99 | C12.1 96.45,33.95 v96.4,33.9 96.4,32.64 97.5,31.54 IR.3 | v91.14,56.52 92.71,54.94 R11.1
  Top 0.813: R13.1 14.35,38.7 WIFI1.49 14.35,60.58 | 14.35,60.58 v13.34,61.59 | v8.26,61.59 3.83,61.59 WIFI1.34 | 14.35,60.58 18.4,56.53 WIFI1.10 24.11,56.53 34.92,45.72 36.83,45.72 | v17.14,66.04 19.07,67.96 WIFI1.19 21.61,67.94 | 36.83,45.72 38.1,44.45 38.1,42.55 38.73,41.91 41.06,41.91 U2.2 41.19,42.04 42.55,42.04 44.15,40.43 C2.1 44.15,31.7 39.37,26.92 36.58,26.92 RFM.5 | C5.2 61.81,53.12 60.96,53.98 50.16,53.98 46.35,50.16 41.27,50.16 36.83,45.72
  Bottom 0.254: v61.66,31 69.1,31 69.98,31.88 v69.98,32.51 | 94.61,38.1 94.61,35.01 95.72,33.9 v96.4,33.9 | v68.36,20.74 65.41,17.78 v53.98,17.78 | v95.89,38.99 95.5,38.99 94.61,38.1 | 94.61,38.1 94.61,52.02 92.71,53.92 92.71,54.94 v91.14,56.52
  Bottom 0.813: v13.34,61.59 12.7,61.59 | 12.7,61.59 v8.26,61.59 | 12.7,61.59 v17.14,66.04
WIFI_ANT
  Top 0.508: 12.7,73.52 ANT1.RF | 12.7,71.7 WIFI1.24
  Top 1.524: 12.7,71.7 12.7,73.52 | 12.7,71.7
WIFI_RX  (via drill 0.41)
  Top 0.254: U1.30 62.87,46.71 v62.87,42.29 | 6.54,42.1 R1.2 6.81,41.73 8.61,43.54 v8.61,43.81
  Bottom 0.254: v62.87,42.29 17.4,42.29 15.88,43.81 v8.61,43.81
WIFI_TX  (via drill 0.41)
  Top 0.254: U1.31 64.14,47.27 v64.14,43.81 | v11.63,40.01 11.64,40.02 R3.2
  Bottom 0.254: v64.14,43.81 64.77,43.18 64.77,41.27 64.14,40.64 48.26,40.64 47.62,40.01 v11.63,40.01

### Text on the board
tPlace: LED Marquee Control v2 | Stephen Caudle | USART2 | GND | RX | TX | GND | MOSI | +5V | CLK | GND | INT | SCL | SDA | AMB | +5V | VCC | TDO | !SRST | + | GND | TDI | !TRST | TCK | GND | VCC | VCC | TMS | - | GND | IR | BAT | + | CS4 | CS3 | CS2 | CS1 | CS0
bPlace: Order 33165